# EAGLE schematic M_D_ext_power_1A (EAGLE 9.6.2)
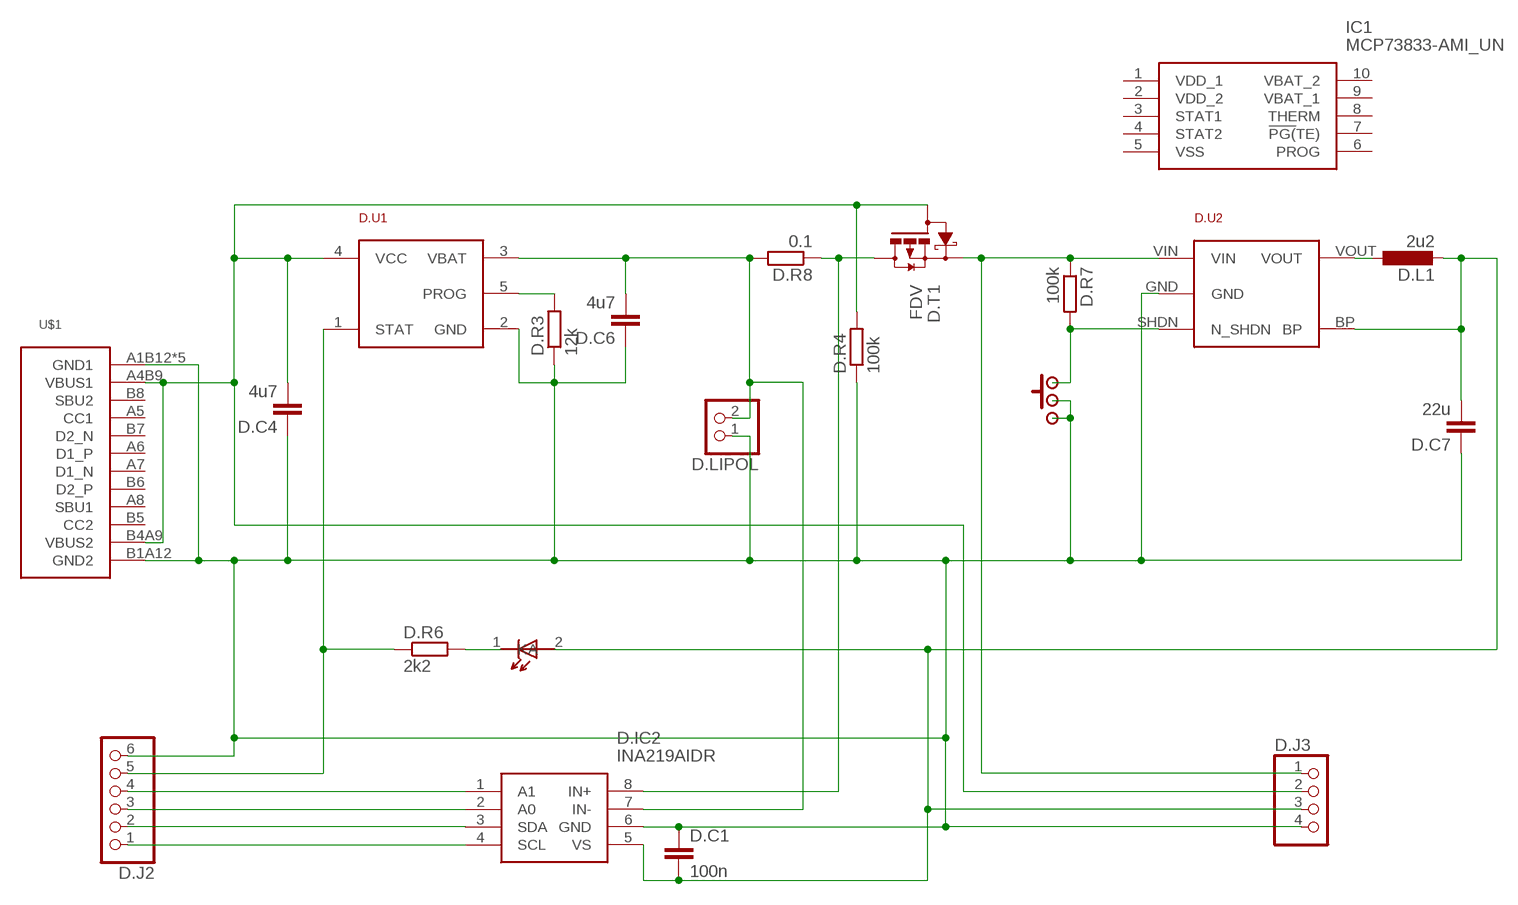
[diagram p0: schematic, sheet 1]

## Parts
D.C1  100n  C-EUC0603  [C0603]
D.C4  4u7  C-EUC0603  [C0603]
D.C6  4u7  C-EUC0603  [C0603]
D.C7  22u  C-EUC0805  [C0805]
D.D1  LED_1.8  [LED_1.8]
D.IC2  INA219AIDR  [SOIC127P600X175-8N]
D.J2  PINHD-1X6  [1X06]
D.J3  PINHD-1X4  [1X04]
D.L1  2u2  L-EUL3230M  [L3230M]
D.LIPOL  PINHD-1X2  [1X02]
D.ON/OFF/RESET  SWITCH  [SWITCH]
D.R3  12k  R-EU_R0603  [R0603]
D.R4  100k  R-EU_R0603  [R0603]
D.R6  2k2  R-EU_R0603  [R0603]
D.R7  100k  R-EU_R0603  [R0603]
D.R8  0.1  R-EU_R0805  [R0805]
D.T1  FDV  P-MOSFET-FDV304P  [SOT23]
D.U1  MCP  MCP73831  [SOT23-5]
D.U2  TC  STABILISER_APE8865  [SOT32-5]
IC1  MCP73833-AMI_UN  [SOP50P490X110-10N]
U$1  USB-C  [USB-C]

## Nets
GND: D.C1.1 D.C4.1 D.C6.1 D.C7.1 D.IC2.6(GND) D.J2.6 D.J3.4 D.LIPOL.1 D.ON/OFF/RESET.P$2 D.ON/OFF/RESET.P$3 D.ON/OFF/RESET.P$5 D.R3.1 D.R4.1 D.U1.2(GND) D.U2.GND U$1.A1B12(GND1) U$1.B1A12(GND2) U$1.SH1(GND1) U$1.SH2(GND1) U$1.SH3(GND1) U$1.SH4(GND1)
N$1: D.IC2.1(A1) D.J2.4
N$2: D.L1.1 D.U2.VOUT
N$3: D.D1.1(K) D.R6.2
N$5: D.ON/OFF/RESET.P$1 D.ON/OFF/RESET.P$4 D.R7.2 D.U2.SHDN(N_SHDN)
N$6: D.IC2.4(SCL) D.J2.1
N$7: D.IC2.3(SDA) D.J2.2
N$8: D.IC2.8(IN+) D.R8.1 D.T1.D
N$9: D.C4.2 D.J3.2 D.R4.2 D.T1.G D.U1.4(VCC) U$1.A4B9(VBUS1) U$1.B4A9(VBUS2)
N$10: D.IC2.2(A0) D.J2.3
N$11: D.R3.2 D.U1.5(PROG)
N$12: D.J3.1 D.R7.1 D.T1.S D.U2.VIN
N$13: D.C6.2 D.IC2.7(IN-) D.LIPOL.2 D.R8.2 D.U1.3(VBAT)
PA7: D.J2.5 D.R6.1 D.U1.1(STAT)
VDD: D.C1.2 D.C7.2 D.D1.2(A) D.IC2.5(VS) D.J3.3 D.L1.2 D.U2.BP
Unconnected: IC1.1(VDD_1) IC1.2(VDD_2) IC1.3(STAT1) IC1.4(STAT2) IC1.5(VSS) IC1.6(PROG) IC1.7(!PG(!TE)) IC1.8(THERM) IC1.9(VBAT_1) IC1.10(VBAT_2) U$1.A5(CC1) U$1.A6(D1_P) U$1.A7(D1_N) U$1.A8(SBU1) U$1.B5(CC2) U$1.B6(D2_P) U$1.B7(D2_N) U$1.B8(SBU2)

## Library data of the parts
D.C1 D.C4 D.C6 D.C7 = rcl:C-EU: CAPACITOR, European symbol; SPICEPREFIX: C
D.D1 = hugo:LED_1.8
D.IC2 = SamacSys_Parts:INA219AIDR: 26-V, Bidirectional, Zero-Drift, High-Side, I2C Out Current/Power Monitor Source: Datasheet <http://www.ti.com/lit/gpn/ina219>; DESCRIPTION: 26-V, Bidirectional, Zero-Drift, High-Side, I2C Out Current/Power Monitor; HEIGHT: 1.75mm; MANUFACTURER_NAME: Texas Instruments; MANUFACTURER_PART_NUMBER: INA219AIDR; MOUSER_PART_NUMBER: 595-INA219AIDR; MOUSER_PRICE-STOCK: https://www.mouser.co.uk/ProductDetail/Texas-Instruments/INA219AIDR?qs=XGzIaZb%2FFYIE5YcOHTnKDA%3D%3D
D.J2 = pinhead2:PINHD-1X6: PIN HEADER
D.J3 = pinhead2:PINHD-1X4: PIN HEADER
D.L1 = rcl:L-EU: INDUCTOR, European symbol; SPICEPREFIX: L
D.LIPOL = pinhead2:PINHD-1X2: PIN HEADER
D.ON/OFF/RESET = hugo:SWITCH
D.R3 D.R4 D.R6-D.R8 = rcl:R-EU_: RESISTOR, European symbol; SPICEPREFIX: R
D.T1 = !stavebnice03:P-MOSFET-FDV304P
D.U1 = !stavebnice03:MCP73831
D.U2 = !stavebnice03:STABILISER_APE8865
IC1 = SamacSys_Parts:MCP73833-AMI_UN: Microchip MCP73833-AMI/UN, Battery Charge Controller Lithium-Ion, Lithium-Polymer, 10-Pin MSOP Source: Datasheet <http://componentsearchengine.com/Datasheets/1/MCP73833-AMI_UN.pdf>; DESCRIPTION: Microchip MCP73833-AMI/UN, Battery Charge Controller Lithium-Ion, Lithium-Polymer, 10-Pin MSOP; HEIGHT: 1.1mm; MANUFACTURER_NAME: Microchip; MANUFACTURER_PART_NUMBER: MCP73833-AMI/UN; MOUSER_PART_NUMBER: 579-MCP73833-AMI/UN; MOUSER_PRICE-STOCK: https://www.mouser.co.uk/ProductDetail/Microchip-Technology/MCP73833-AMI-UN?qs=Fxu3fLyJv8fd%2FGnsUSC9lg%3D%3D
U$1 = hugo:USB-C